# Altium schematic sheet [14] PWR2.SchDoc: Power supply
size A4; Engineer: M. Folejewski; DocumentNumber: 13; SheetNumber: 13; SheetTotal: 15; PageSize: A4; Designators: 900-949
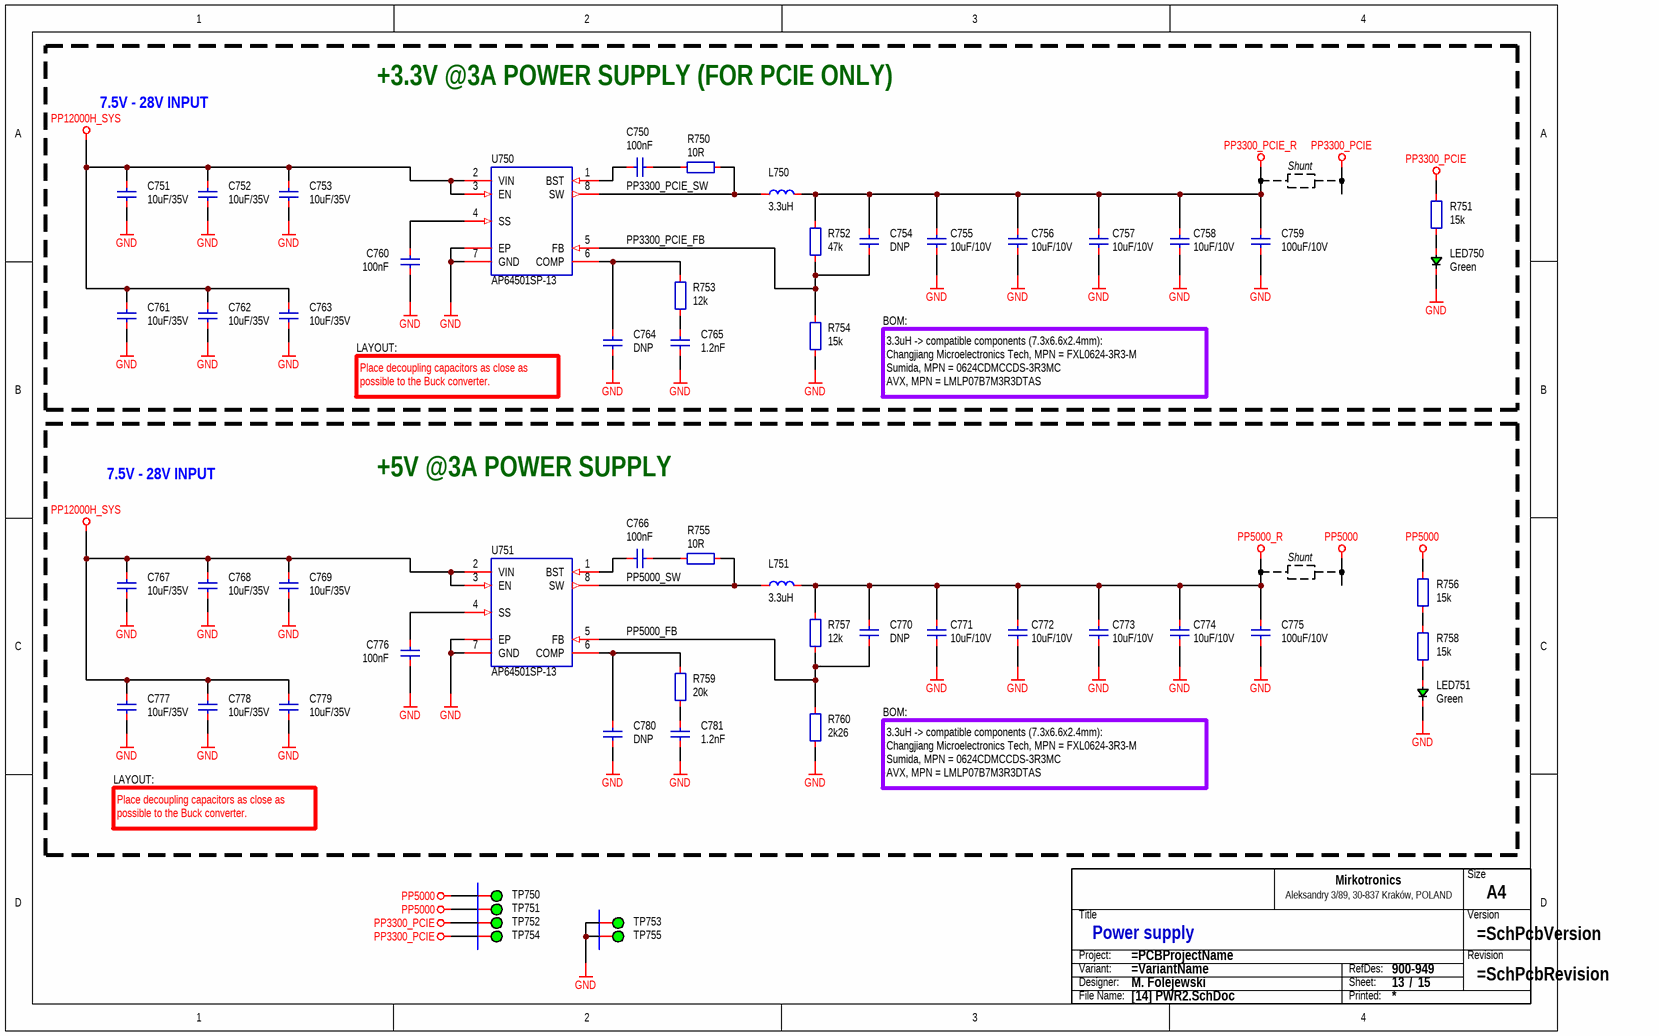
[diagram p0: [14] PWR2.SchDoc]

## Parts
C750  100nF  [CAP_0603_R]
C751  10uF/35V  [CAP_1206_R]
C752  10uF/35V  [CAP_1206_R]
C753  10uF/35V  [CAP_1206_R]
C754  DNP  [CAP_0603_R]
C755  10uF/10V  [CAP_0603_R]
C756  10uF/10V  [CAP_0603_R]
C757  10uF/10V  [CAP_0603_R]
C758  10uF/10V  [CAP_0603_R]
C759  100uF/10V  [CAP_1206_R]
C760  100nF  [CAP_0603_R]
C761  10uF/35V  [CAP_1206_R]
C762  10uF/35V  [CAP_1206_R]
C763  10uF/35V  [CAP_1206_R]
C764  DNP  [CAP_0603_R]
C765  1.2nF  [CAP_0603_R]
C766  100nF  [CAP_0603_R]
C767  10uF/35V  [CAP_1206_R]
C768  10uF/35V  [CAP_1206_R]
C769  10uF/35V  [CAP_1206_R]
C770  DNP  [CAP_0603_R]
C771  10uF/10V  [CAP_0603_R]
C772  10uF/10V  [CAP_0603_R]
C773  10uF/10V  [CAP_0603_R]
C774  10uF/10V  [CAP_0603_R]
C775  100uF/10V  [CAP_1206_R]
C776  100nF  [CAP_0603_R]
C777  10uF/35V  [CAP_1206_R]
C778  10uF/35V  [CAP_1206_R]
C779  10uF/35V  [CAP_1206_R]
C780  DNP  [CAP_0603_R]
C781  1.2nF  [CAP_0603_R]
L750  3.3uH  [IND_SUM_0624CDMCCDS_700X660X240_R]
L751  3.3uH  [IND_SUM_0624CDMCCDS_700X660X240_R]
LED750  Green  [LED_0805_GRN_R]
LED751  Green  [LED_0805_GRN_R]
R750  10R  [RES_0603_R]
R751  15k  [RES_0603_R]
R752  47k  [RES_0603_R]
R753  12k  [RES_0603_R]
R754  15k  [RES_0603_R]
R755  10R  [RES_0603_R]
R756  15k  [RES_0603_R]
R757  12k  [RES_0603_R]
R758  15k  [RES_0603_R]
R759  20k  [RES_0603_R]
R760  2k26  [RES_0603_R]
TB?  Title block  (value not drawn)  (graphical)
TP750  ICT  [PCB_TP_ICT_100]  (value not drawn)  (no BOM)
TP751  ICT  [PCB_TP_ICT_100]  (value not drawn)  (no BOM)
TP752  ICT  [PCB_TP_ICT_100]  (value not drawn)  (no BOM)
TP753  ICT  [PCB_TP_ICT_100]  (value not drawn)  (no BOM)
TP754  ICT  [PCB_TP_ICT_100]  (value not drawn)  (no BOM)
TP755  ICT  [PCB_TP_ICT_100]  (value not drawn)  (no BOM)
U750  AP64501SP-13  [ICC_SOIC8N_TP_R]
U751  AP64501SP-13  [ICC_SOIC8N_TP_R]

## Nets
GND: C751.1 C752.1 C753.1 C755.1 C756.1 C757.1 C758.1 C759.1 C760.1 C761.1 C762.1 C763.1 C764.1 C765.1 C767.1 C768.1 C769.1 C771.1 C772.1 C773.1 C774.1 C775.1 C776.1 C777.1 C778.1 C779.1 C780.1 C781.1 LED750.1 LED751.1 R754.1 R760.1 TP753.1 TP755.1 U750.7(GND) U750.EP U751.7(GND) U751.EP
PP3300_PCIE: R751.2 TP752.1 TP754.1
PP3300_PCIE_R: C754.2 C755.2 C756.2 C757.2 C758.2 C759.2 L750.2 R752.2
PP5000: R756.2 TP750.1 TP751.1
PP5000_R: C770.2 C771.2 C772.2 C773.2 C774.2 C775.2 L751.2 R757.2
PP12000H_SYS: C751.2 C752.2 C753.2 C761.2 C762.2 C763.2 C767.2 C768.2 C769.2 C777.2 C778.2 C779.2 U750.2(VIN) U750.3(EN) U751.2(VIN) U751.3(EN)
PP3300_PCIE_FB: C754.1 R752.1 R754.2 U750.5(FB)
PP3300_PCIE_SW: L750.1 R750.2 U750.8(SW)
PP5000_FB: C770.1 R757.1 R760.2 U751.5(FB)
PP5000_SW: L751.1 R755.2 U751.8(SW)
NetC750_1: C750.1 U750.1(BST)
NetC750_2: C750.2 R750.1
NetC760_2: C760.2 U750.4(SS)
NetC764_2: C764.2 R753.2 U750.6(COMP)
NetC765_2: C765.2 R753.1
NetC766_1: C766.1 U751.1(BST)
NetC766_2: C766.2 R755.1
NetC776_2: C776.2 U751.4(SS)
NetC780_2: C780.2 R759.2 U751.6(COMP)
NetC781_2: C781.2 R759.1
NetLED750_2: LED750.2 R751.1
NetLED751_2: LED751.2 R758.1
NetR756_1: R756.1 R758.2

## Notes on the sheet
- 7.5V - 28V INPUT
- +3.3V @3A POWER SUPPLY (FOR PCIE ONLY)
- Shunt
- LAYOUT:
- BOM:
- Place decoupling capacitors as close as possible to the Buck converter.
- 3.3uH -> compatible components (7.3x6.6x2.4mm):
  Changjiang Microelectronics Tech, MPN = FXL0624-3R3-M
  Sumida, MPN = 0624CDMCCDS-3R3MC
  AVX, MPN = LMLP07B7M3R3DTAS
- +5V @3A POWER SUPPLY
- (in symbol SCH_TITLE_BLOCK_MIRKOTRONICS_V2) Size; Mirkotronics; Aleksandry 3/89, 30-837 Kraków, POLAND; Title; Version; Project:; Revision; Variant:; RefDes:; Designer:; Sheet:; /; File Name:; Printed:

## Library data of the parts
C750 C760 C766 C776 = CAP-0008: Capacitor; MLCC; 100nF; TBD; TBD; TBD; TBD; SMD; 0603 (1608);; Component Type: Capacitor; Component Subtype: MLCC; Value: 100nF; Manufacturer: TBD; MPN: TBD; Mounting Type: SMD; Package (Case): 0603 (1608); Supplier: ?
C751-C753 C759 C761-C763 C767-C769 C775 C777-C779 = CAP-0025: Capacitor; MLCC; GENERIC; TBD; TBD; TBD; TBD; SMD; 1206 (3216);; Component Type: Capacitor; Component Subtype: MLCC; Manufacturer: GENERIC; MPN: GENERIC; Mounting Type: SMD; Package (Case): 1206 (3216); Supplier: ?
  C751-C753 C761-C763 C767-C769 C777-C779: Value: 10uF/35V
  C759 C775: Value: 100uF/10V
C754-C758 C764 C765 C770-C774 C780 C781 = CAP-0023: Capacitor; MLCC; GENERIC; TBD; TBD; TBD; TBD; SMD; 0603 (1608);; Component Type: Capacitor; Component Subtype: MLCC; Manufacturer: GENERIC; MPN: GENERIC; Mounting Type: SMD; Package (Case): 0603 (1608)
  C754 C764 C770 C780: ID: CAP-0023; Value: DNP; Component Body: TBD; Component Height: TBD; Packaging Type: TBD; ROHS Status: TBD; Operating Temperature: TBD; Capacitance: DNP; Voltage Rating: TBD; Dielectric: TBD; Tolerance: TBD; Features: TBD
  C755-C758 C771-C774: Value: 10uF/10V; Supplier: ?
  C765 C781: ID: CAP-0023; Value: 1.2nF; Component Body: TBD; Component Height: TBD; Packaging Type: TBD; ROHS Status: TBD; Operating Temperature: TBD; Capacitance: 1.2nF; Voltage Rating: TBD; Dielectric: TBD; Tolerance: TBD; Features: TBD
L750 L751 = IND: Inductor;; Manufacturer: Changjiang Microelectronics Tech; MPN: FXL0624-3R3-M; Component Subtype: Power Inductor; Package (Case): SMD; Value: 3.3uH; Component Type: Inductor; Mounting Type: SMD; Supplier: ?
LED750 LED751 = DIO_LED_GRN: Diode; LED; Green;; Manufacturer: Foshan NationStar Optoelectronics; MPN: NCD0805G1; Component Subtype: LED Diode; Package (Case): 0805 (2012); Value: Green; Component Type: LED; Mounting Type: SMD; Supplier: LCSC
R750 R755 = RES-0025: Resistor; Thick Film; 10R; 1%; 100mW; 100PPM; 75V; Standard; SMD; 0603 (1608);; Manufacturer: Yageo Corporation; MPN: TBD; Component Body: 1.60 x 0.80mm; Packaging Type: Tape & Reel; ID: RES-0025; Component Type: Resistor; Component Subtype: Thick Film; Value: 10R; Mounting Type: SMD; Package (Case): 0603 (1608); Component Height: 0.45mm; ROHS Status: RoHS Compliant; Operating Temperature: -55°C to +155°C; Resistance: 10R; Tolerance: 1%; Power Rating: 100mW; TCR: 100PPM; Voltage Rating: 75V; Features: Standard
R751 R756 R758 = RES-0043: Resistor; Thick Film; 15k; 1%; 100mW; 100PPM; 75V; Standard; SMD; 0603 (1608);; Manufacturer: Yageo Corporation; MPN: TBD; Component Type: Resistor; Component Subtype: Thick Film; Value: 15k; Mounting Type: SMD; Package (Case): 0603 (1608); Supplier: ?
R752 = RES-0044: Resistor; Thick Film; 47k; 1%; 100mW; 100PPM; 75V; Standard; SMD; 0603 (1608);; Manufacturer: Yageo Corporation; MPN: RC0603FR-0747KL; Component Body: 1.60 x 0.80mm; Packaging Type: Tape & Reel; ID: RES-0044; Component Type: Resistor; Component Subtype: Thick Film; Value: 47k; Mounting Type: SMD; Package (Case): 0603 (1608); Component Height: 0.45mm; ROHS Status: RoHS Compliant; Operating Temperature: -55°C to +155°C; Resistance: 47k; Tolerance: 1%; Power Rating: 100mW; TCR: 100PPM; Voltage Rating: 75V; Features: Standard
R753 R757 = RES-0053: Resistor; Thick Film; 12k; 1%; 100mW; 100PPM; 75V; Standard; SMD; 0603 (1608);; Manufacturer: Yageo Corporation; MPN: TBD; Component Body: 1.60 x 0.80mm; Packaging Type: Tape & Reel; ID: RES-0053; Component Type: Resistor; Component Subtype: Thick Film; Value: 12k; Mounting Type: SMD; Package (Case): 0603 (1608); Component Height: 0.45mm; ROHS Status: RoHS Compliant; Operating Temperature: -55°C to +155°C; Resistance: 12k; Tolerance: 1%; Power Rating: 100mW; TCR: 100PPM; Voltage Rating: 75V; Features: Standard
R754 R759 = RES-0054: Resistor; Thick Film; GENERIC; TBD; TBD; TBD; TBD; TBD; SMD; 0603 (1608);; Component Body: 1.60 x 0.80mm; ID: RES-0054; Component Type: Resistor; Component Subtype: Thick Film; Manufacturer: GENERIC; MPN: GENERIC; Mounting Type: SMD; Package (Case): 0603 (1608); Component Height: TBD; Packaging Type: TBD; ROHS Status: TBD; Operating Temperature: TBD; Tolerance: TBD; Power Rating: TBD; TCR: TBD; Voltage Rating: TBD; Features: TBD
  R754: Value: 15k; Resistance: 15k
  R759: Value: 20k; Resistance: 20k
R760 = RES-0033: Resistor; Thick Film; 2k26; 1%; 100mW; 100PPM; 75V; Standard; SMD; 0603 (1608);; Manufacturer: Yageo Corporation; MPN: TBD; Component Body: 1.60 x 0.80mm; Packaging Type: Tape & Reel; ID: RES-0033; Component Type: Resistor; Component Subtype: Thick Film; Value: 2k26; Mounting Type: SMD; Package (Case): 0603 (1608); Component Height: 0.45mm; ROHS Status: RoHS Compliant; Operating Temperature: -55°C to +155°C; Resistance: 2k26; Tolerance: 1%; Power Rating: 100mW; TCR: 100PPM; Voltage Rating: 75V; Features: Standard
TB? = SCH_TITLE_BLOCK_MIRKOTRONICS_V2: Component Type: Title block; Manufacturer: -; Mounting Type: Non component; MPN: -; Operating Temperature: -; Package: -; Specification: Title block; Value: Title block; Replacement: -; System: ?
TP750-TP755 = PCB_TP_ICT: Test Point (ICT); Specification: Testpoint (for ICT), SMD pad; Component Type: Testpoint (for ICT); Manufacturer: -; Mounting Type: Non component; MPN: -; Value: ICT
U750 U751 = ICC_DDI_AP64501_SO8_EP: IC; Buck regulator;; Manufacturer: Diodes Incorporated; Specification: Synchronous step-down DC-DC converter, 3.8V to 40V input, 5A, 570kHz, SOIC8 package; Component Type: IC; Mounting Type: SMD; MPN: AP64501SP-13; Operating Temperature: -40°C to +85°C; Package: SOIC8; Value: AP64501SP-13